# EAGLE design Power_Delivery_PCB (EAGLE 9.7.0)
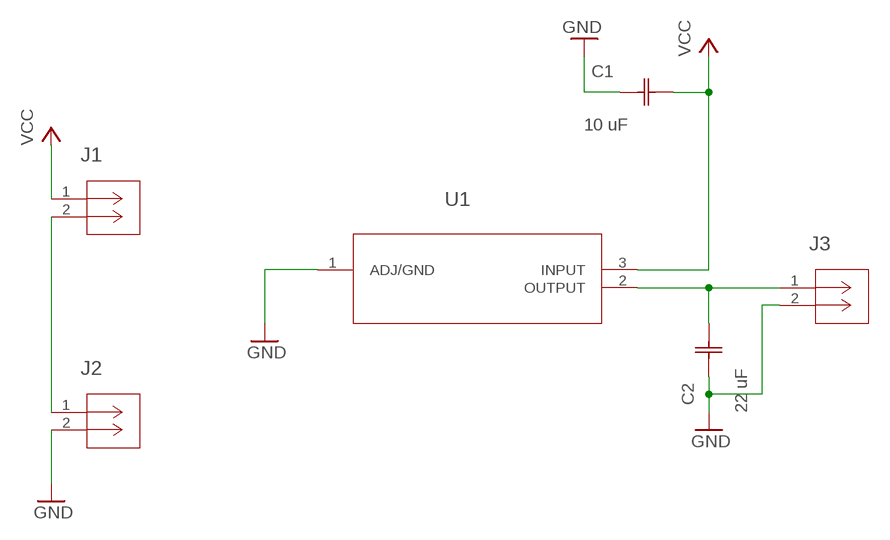
[diagram p0: schematic, sheet 1]

## Parts
C1  10 uF  GRM21BR61C106KE15LG-21_MUR-L  [G-21_MUR-L]
C2  22 uF  GRM188R60G226MEA0DG-188_MUR-L  [G-188_MUR-L]
J1  B2B-PH-K-S(LF)(SN)CONN_B2B-PH-K-S(LF)(SN)_JST  [CONN_B2B-PH-K-S(LF)(SN)_JST]
J2  B2B-PH-K-S(LF)(SN)CONN_B2B-PH-K-S(LF)(SN)_JST  [CONN_B2B-PH-K-S(LF)(SN)_JST]
J3  B2B-PH-K-S(LF)(SN)CONN_B2B-PH-K-S(LF)(SN)_JST  [CONN_B2B-PH-K-S(LF)(SN)_JST]
U1  AZ1117IH-3.3TRG1SOT223_AZ1117I_6P5X3P5_DIO-L  [SOT223_AZ1117I_6P5X3P5_DIO-L]

## Nets
GND: C1.1 C2.1 J2.2 J3.2 U1.1(ADJ/GND)
N$1: J1.2 J2.1
N$2: C2.2 J3.1 U1.2(OUTPUT)
VCC: C1.2 J1.1 U1.3(INPUT)

## Library data of the parts
C1 = Cap10uF_2:GRM21BR61C106KE15L; COPYRIGHT: Copyright (C) 2023 Ultra Librarian. All rights reserved.; MANUFACTURER_PART_NUMBER: GRM21BR61C106KE15L; MFR_NAME: Murata
C2 = Cap22uF:GRM188R60G226MEA0D; COPYRIGHT: Copyright (C) 2023 Ultra Librarian. All rights reserved.; MANUFACTURER_PART_NUMBER: GRM188R60G226MEA0D; MFR_NAME: Murata
J1-J3 = 2023-10-24_23-33-47_Library:B2B-PH-K-S(LF)(SN); COPYRIGHT: Copyright (C) 2023 Ultra Librarian. All rights reserved.; MANUFACTURER_PART_NUMBER: B2B-PH-K-S(LF)(SN); MFR_NAME: JST
U1 = regulator:AZ1117IH-3.3TRG1; COPYRIGHT: Copyright (C) 2023 Ultra Librarian. All rights reserved.; MANUFACTURER_PART_NUMBER: AZ1117IH-3.3TRG1; MFR_NAME: Diodes Inc

## Board
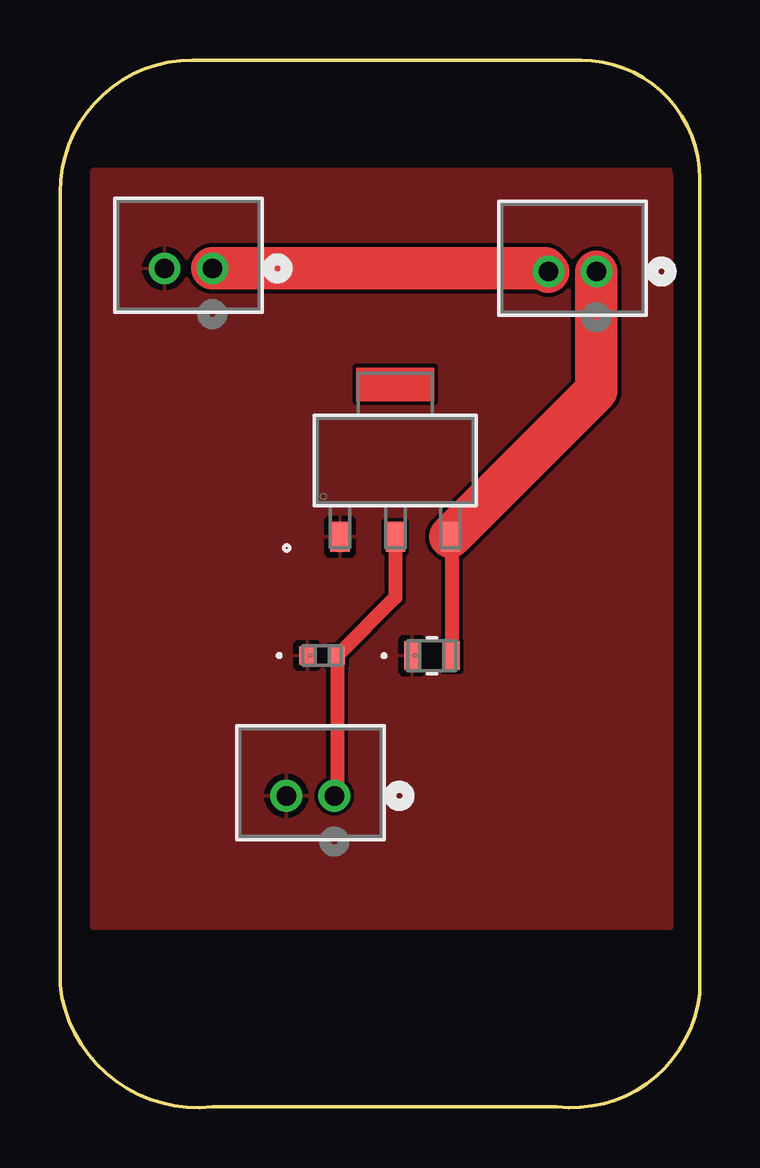
[diagram p1: board, top side]
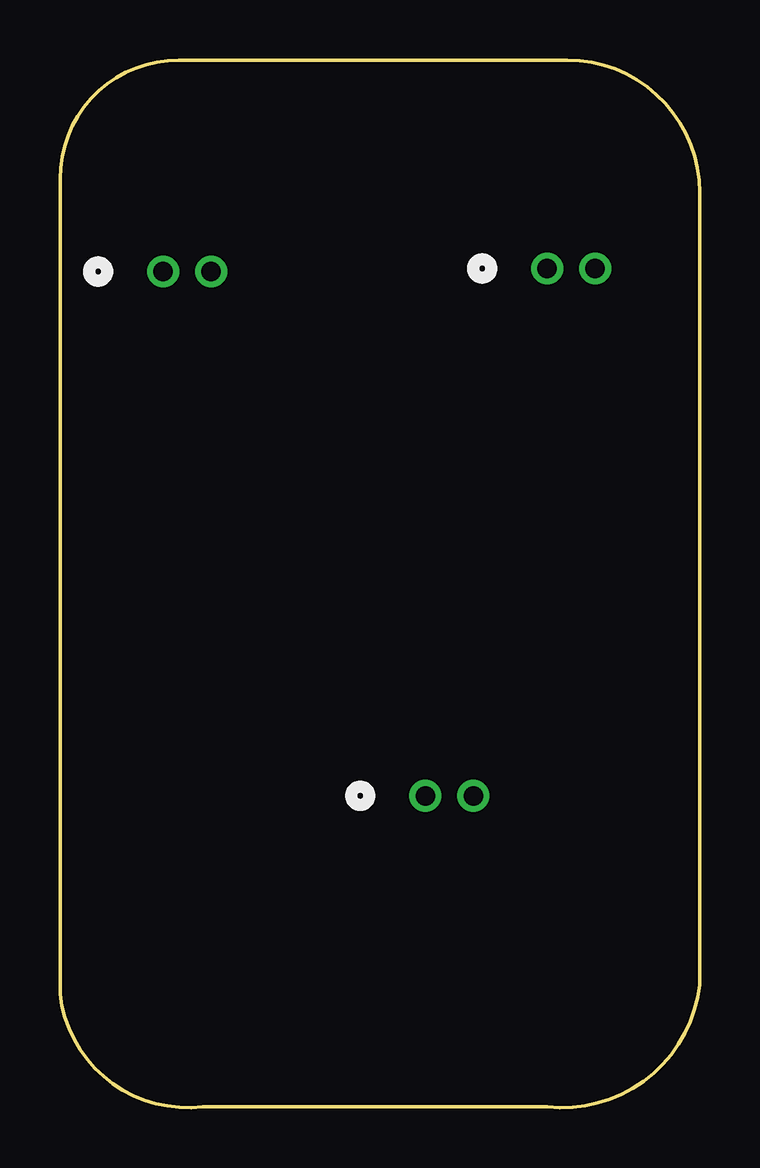
[diagram p2: board, bottom side, seen from below]

Size 26.65 x 43.65 mm. Coordinates in mm from the lower left corner, seen from the top.
Outline: 5.51,43.65 arc90 0,38.14 0,5.12 arc90 6.35,0.04 20.7,0.04 arc90 26.65,4.72 26.65,38.71 arc90 21.71,43.65 5.51,43.65
Copper layers (1*16): Top / Bottom
Stack-up Default Layer Stack: Top User Defined 0.035mm / Dielectric-1 User Defined 1.5mm / Bottom User Defined 0.035mm
Design rules: minimum copper width 6mil, minimum drill size 0.35mm, copper clearance wire_polygon to wire_polygon 6mil, copper clearance wire_polygon to pad_smd 6mil, copper clearance wire_polygon to via 6mil, copper clearance pad_smd to pad_smd 6mil, copper clearance pad_smd to via 6mil, copper clearance via to via 6mil, copper clearance smd to pad (same net) 6mil, copper clearance smd to via (same net) 6mil, copper clearance smd to smd (same net) 6mil, dimension clearance 40mil, restrict clearance 0mil, drill distance 6mil, keepout clearance 0mil

### Footprints (pad centres in the part's own frame; a part is rotated, then mirrored left to right if it is on the bottom)
G-21_MUR-L = smd 0.66 x 1.194: 1 -0.826,0; 2 0.826,0
G-188_MUR-L = smd 0.66 x 0.762: 1 -0.622,0; 2 0.622,0
CONN_B2B-PH-K-S(LF)(SN)_JST = drill 0.813 pad 1.321: 1 0,0; 2 -2,0
SOT223_AZ1117I_6P5X3P5_DIO-L = smd 0.813 x 1.245: 1 -2.3,-3.175; 2 0,-3.175; 3 2.3,-3.175

### Placement (x,y rotation side)
C1  15.49,18.83 0 top
C2  10.92,18.83 0 top
J1  22.35,34.83 0 top
J2  6.35,34.96 0 top
J3  11.43,12.99 0 top
U1  13.97,26.96 0 top

### Tracks (layer width: path | path; a pad name or v marks a point on that pad's centre or on a via)
GND
  pour Top: 1.27,39.15 26.16,39.15 26.16,7.4 1.27,7.4
N$1
  Top 1.778: J2.1 20.23,34.96 J1.2
N$2
  Top 0.584: U1.2 13.97,21.26 C2.2 11.54,13.1 J3.1
VCC
  Top 0.254: C1.2 16.27,18.88
  Top 0.584: U1.3 16.32,23.74 C1.2
  Top 1.778: J1.1 22.35,29.87 U1.3